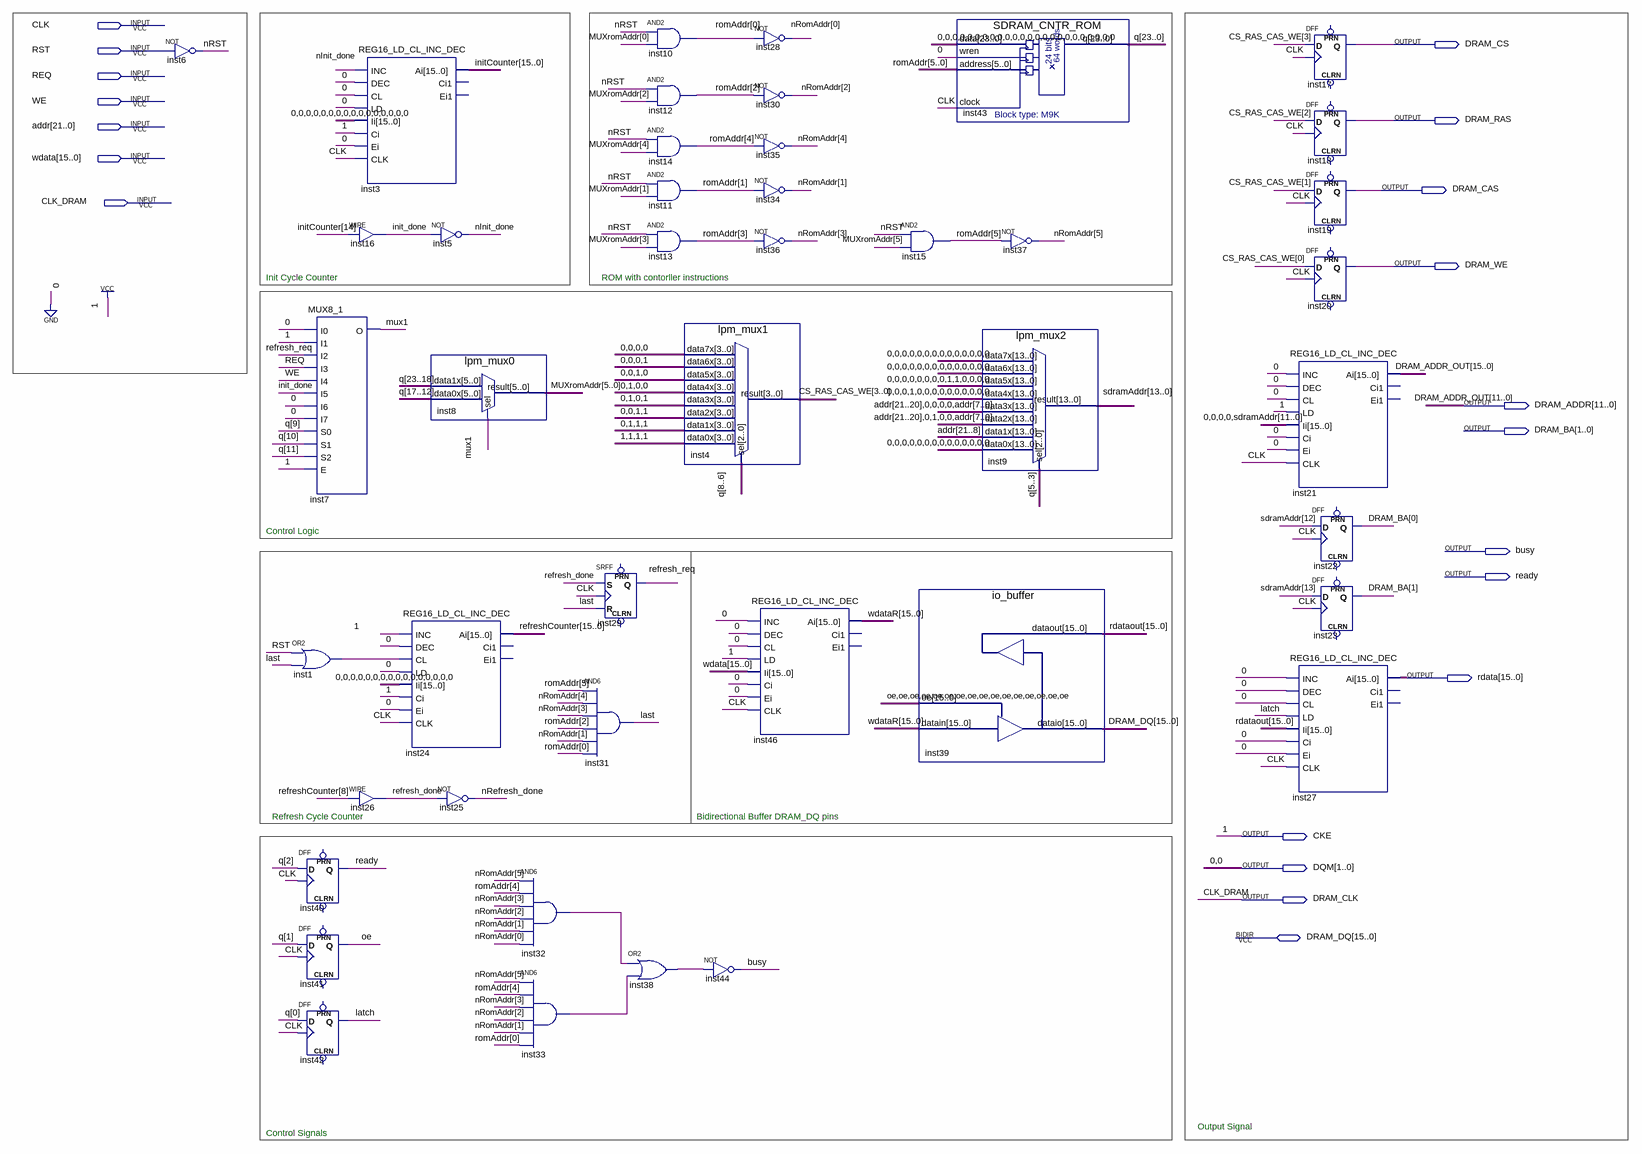
[diagram p0: schematic sheet]
// Quartus schematic SDRAM_CNTR.bdf as structural Verilog: 44 symbols, 20 pins
module SDRAM_CNTR (
  input  CLK,
  input  RST,
  input  REQ,
  input  WE,
  input  [21:0] addr,
  input  [15:0] wdata,
  input  CLK_DRAM,
  inout  [15:0] DRAM_DQ,
  output DRAM_CS,
  output DRAM_RAS,
  output DRAM_CAS,
  output DRAM_WE,
  output [11:0] DRAM_ADDR,
  output [1:0] DRAM_BA,
  output busy,
  output ready,
  output [15:0] rdata,
  output CKE,
  output [1:0] DQM,
  output DRAM_CLK
);

  wire init_done, inst1_out, inst32_out, inst33_out, inst38_out, last, latch, mux1, nInit_done,
       nRefresh_done, nRST, oe, refresh_done, refresh_req;
  wire [3:0] CS_RAS_CAS_WE;
  wire [5:0] MUXromAddr, nRomAddr, romAddr;
  wire [13:0] sdramAddr;
  wire [15:0] initCounter, rdataout, refreshCounter, wdataR;
  wire [15:12] DRAM_ADDR_OUT;
  wire [23:0] q;

  not inst6 (nRST, RST);
  MUX8_1 inst7 (
    .I0(1'b0), .I1(1'b1), .I2(refresh_req), .I3(REQ), .I4(WE), .I5(init_done), .I6(1'b0), .I7(1'b0),
    .S0(q[9]), .S1(q[10]), .S2(q[11]), .E(1'b1), .O(mux1));
  or inst1 (inst1_out, RST, last);
  DFF inst40 (.CLK(CLK), .D(q[2]), .Q(ready));  // open: CLRN, PRN
  DFF inst41 (.CLK(CLK), .D(q[1]), .Q(oe));  // open: CLRN, PRN
  DFF inst42 (.CLK(CLK), .D(q[0]), .Q(latch));  // open: CLRN, PRN
  REG16_LD_CL_INC_DEC inst3 (
    .INC(nInit_done), .DEC(1'b0), .CL(1'b0), .LD(1'b0), .Ii({16{1'b0}}), .Ci(1'b1), .Ei(1'b0), .CLK(CLK),
    .Ai(initCounter));  // open: Ci1, Ei1
  assign init_done = initCounter[14];  // WIRE inst16
  assign refresh_done = refreshCounter[8];  // WIRE inst26
  REG16_LD_CL_INC_DEC inst24 (
    .INC(1'b1), .DEC(1'b0), .CL(inst1_out), .LD(1'b0), .Ii({16{1'b0}}), .Ci(1'b1), .Ei(1'b0), .CLK(CLK),
    .Ai(refreshCounter));  // open: Ci1, Ei1
  not inst5 (nInit_done, init_done);
  lpm_mux0 inst8 (.data1x(q[23:18]), .data0x(q[17:12]), .sel(mux1), .result(MUXromAddr));
  not inst25 (nRefresh_done, refresh_done);
  and inst32 (inst32_out, nRomAddr[5], romAddr[4], nRomAddr[3], nRomAddr[2], nRomAddr[1], nRomAddr[0]);
  and inst33 (inst33_out, nRomAddr[5], romAddr[4], nRomAddr[3], nRomAddr[2], nRomAddr[1], romAddr[0]);
  SRFF inst29 (.S(refresh_done), .R(last), .CLK(CLK), .Q(refresh_req));  // open: PRN, CLRN
  and inst31 (last, romAddr[5], nRomAddr[4], nRomAddr[3], romAddr[2], nRomAddr[1], romAddr[0]);
  and inst10 (romAddr[0], nRST, MUXromAddr[0]);
  and inst12 (romAddr[2], nRST, MUXromAddr[2]);
  and inst14 (romAddr[4], nRST, MUXromAddr[4]);
  and inst11 (romAddr[1], nRST, MUXromAddr[1]);
  and inst13 (romAddr[3], nRST, MUXromAddr[3]);
  or inst38 (inst38_out, inst32_out, inst33_out);
  lpm_mux1 inst4 (
    .data7x(4'b0000), .data6x(4'b0001), .data5x(4'b0010), .data4x(4'b0100), .data3x(4'b0101),
    .data2x(4'b0011), .data1x(4'b0111), .data0x(4'b1111), .sel(q[8:6]), .result(CS_RAS_CAS_WE));
  not inst44 (busy, inst38_out);
  not inst28 (nRomAddr[0], romAddr[0]);
  not inst30 (nRomAddr[2], romAddr[2]);
  not inst35 (nRomAddr[4], romAddr[4]);
  not inst34 (nRomAddr[1], romAddr[1]);
  not inst36 (nRomAddr[3], romAddr[3]);
  REG16_LD_CL_INC_DEC inst46 (
    .INC(1'b0), .DEC(1'b0), .CL(1'b0), .LD(1'b1), .Ii(wdata), .Ci(1'b0), .Ei(1'b0), .CLK(CLK), .Ai(wdataR));  // open: Ci1, Ei1
  and inst15 (romAddr[5], nRST, MUXromAddr[5]);
  SDRAM_CNTR_ROM inst43 (.data({24{1'b0}}), .wren(1'b0), .address(romAddr), .clock(CLK), .q(q));
  io_buffer inst39 (.datain(wdataR), .oe({16{oe}}), .dataout(rdataout), .dataio(DRAM_DQ));
  not inst37 (nRomAddr[5], romAddr[5]);
  lpm_mux2 inst9 (
    .data7x({14{1'b0}}), .data6x({14{1'b0}}), .data5x(14'b00000000110000), .data4x(14'b00010000000000),
    .data3x({addr[21:20], 4'b0000, addr[7:0]}), .data2x({addr[21:20], 4'b0100, addr[7:0]}),
    .data1x(addr[21:8]), .data0x({14{1'b0}}), .sel(q[5:3]), .result(sdramAddr));
  DFF inst17 (.CLK(CLK), .D(CS_RAS_CAS_WE[3]), .Q(DRAM_CS));  // open: CLRN, PRN
  DFF inst18 (.CLK(CLK), .D(CS_RAS_CAS_WE[2]), .Q(DRAM_RAS));  // open: CLRN, PRN
  DFF inst19 (.CLK(CLK), .D(CS_RAS_CAS_WE[1]), .Q(DRAM_CAS));  // open: CLRN, PRN
  DFF inst20 (.CLK(CLK), .D(CS_RAS_CAS_WE[0]), .Q(DRAM_WE));  // open: CLRN, PRN
  REG16_LD_CL_INC_DEC inst21 (
    .INC(1'b0), .DEC(1'b0), .CL(1'b0), .LD(1'b1), .Ii({4'b0000, sdramAddr[11:0]}), .Ci(1'b0), .Ei(1'b0),
    .CLK(CLK), .Ai({DRAM_ADDR_OUT, DRAM_ADDR}));  // open: Ci1, Ei1
  DFF inst22 (.CLK(CLK), .D(sdramAddr[12]), .Q(DRAM_BA[0]));  // open: CLRN, PRN
  DFF inst23 (.CLK(CLK), .D(sdramAddr[13]), .Q(DRAM_BA[1]));  // open: CLRN, PRN
  REG16_LD_CL_INC_DEC inst27 (
    .INC(1'b0), .DEC(1'b0), .CL(1'b0), .LD(latch), .Ii(rdataout), .Ci(1'b0), .Ei(1'b0), .CLK(CLK), .Ai(rdata));  // open: Ci1, Ei1

  assign CKE = 1'b1;
  assign DQM = 2'b00;
  assign DRAM_CLK = CLK_DRAM;

  // Other names for the same wires on the sheet: DRAM_ADDR_OUT[11:0] = DRAM_ADDR

  // Notes on the sheet:
  //   Init Cycle Counter
  //   ROM with contorller instructions
  //   Control Logic
  //   Refresh Cycle Counter
  //   Bidirectional Buffer DRAM_DQ pins
  //   Output Signal
  //   Control Signals
endmodule
